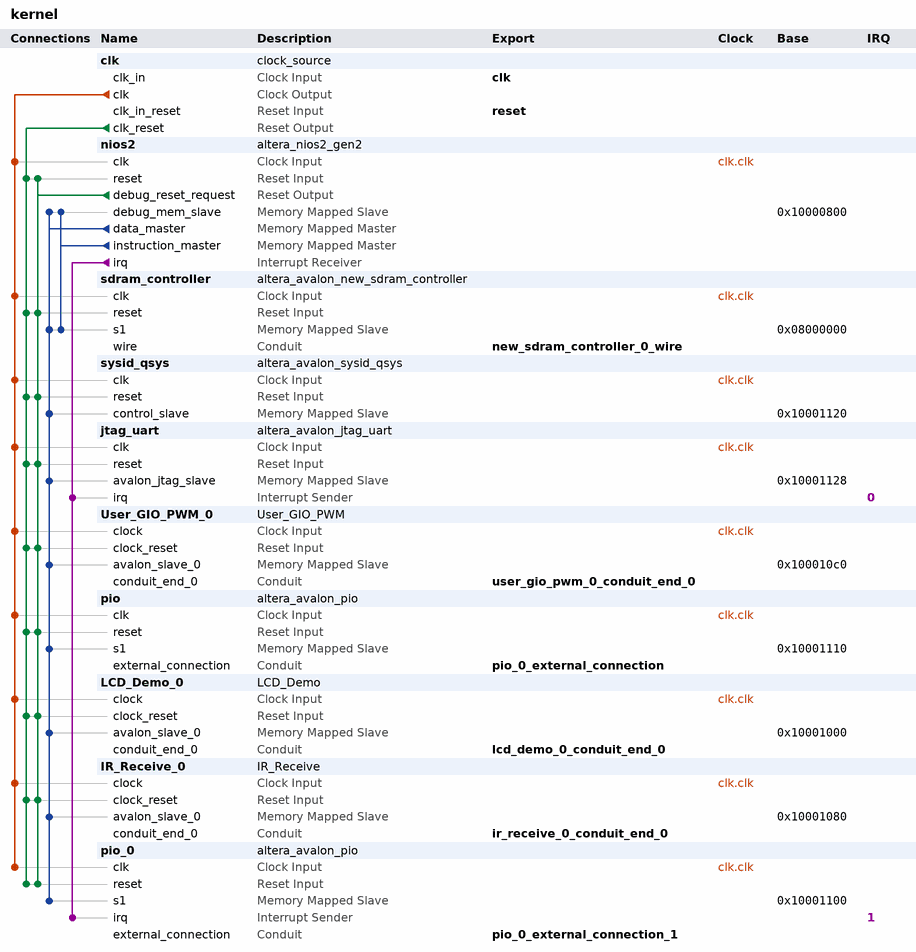
[diagram p0: system contents]
# Platform Designer (Qsys) system kernel, Cyclone IV E EP4CE115F29C7
# Parameters at their usual value, and those the tool derives, are not listed.
package require -exact qsys 15.0
create_system kernel
set_project_property DEVICE_FAMILY {Cyclone IV E}
set_project_property DEVICE EP4CE115F29C7

add_instance clk clock_source 15.0
set_instance_parameter_value clk clockFrequency 100000000

add_instance nios2 altera_nios2_gen2 15.0
set_instance_parameter_value nios2 dcache_size 0
set_instance_parameter_value nios2 debug_datatrigger 2
set_instance_parameter_value nios2 debug_hwbreakpoint 2
set_instance_parameter_value nios2 debug_traceType instruction_and_data_trace
set_instance_parameter_value nios2 exceptionSlave sdram_controller.s1
set_instance_parameter_value nios2 icache_size 4096
set_instance_parameter_value nios2 impl Fast
set_instance_parameter_value nios2 resetSlave sdram_controller.s1

add_instance sdram_controller altera_avalon_new_sdram_controller 15.0
set_instance_parameter_value sdram_controller TAC 5.5
set_instance_parameter_value sdram_controller TRCD 20.0
set_instance_parameter_value sdram_controller TRP 20.0
set_instance_parameter_value sdram_controller casLatency 3
set_instance_parameter_value sdram_controller columnWidth 10
set_instance_parameter_value sdram_controller dataWidth 32
set_instance_parameter_value sdram_controller generateSimulationModel false
set_instance_parameter_value sdram_controller model single_Micron_MT48LC4M32B2_7_chip
set_instance_parameter_value sdram_controller numberOfBanks 4
set_instance_parameter_value sdram_controller numberOfChipSelects 1
set_instance_parameter_value sdram_controller powerUpDelay 100.0
set_instance_parameter_value sdram_controller refreshPeriod 15.625
set_instance_parameter_value sdram_controller rowWidth 13

add_instance sysid_qsys altera_avalon_sysid_qsys 15.0
set_instance_parameter_value sysid_qsys id 1

add_instance jtag_uart altera_avalon_jtag_uart 15.0
set_instance_parameter_value jtag_uart simInteractiveOptions NO_INTERACTIVE_WINDOWS

add_instance User_GIO_PWM_0 User_GIO_PWM 1.0

add_instance pio altera_avalon_pio 15.0
set_instance_parameter_value pio direction Output
set_instance_parameter_value pio width 1

add_instance LCD_Demo_0 LCD_Demo 1.0

add_instance IR_Receive_0 IR_Receive 1.0

add_instance pio_0 altera_avalon_pio 15.0
set_instance_parameter_value pio_0 captureEdge true
set_instance_parameter_value pio_0 direction Input
set_instance_parameter_value pio_0 generateIRQ true
set_instance_parameter_value pio_0 irqType EDGE
set_instance_parameter_value pio_0 width 1

# connections
add_connection clk.clk IR_Receive_0.clock clock
add_connection clk.clk jtag_uart.clk clock
add_connection clk.clk LCD_Demo_0.clock clock
add_connection clk.clk nios2.clk clock
add_connection clk.clk pio.clk clock
add_connection clk.clk pio_0.clk clock
add_connection clk.clk sdram_controller.clk clock
add_connection clk.clk sysid_qsys.clk clock
add_connection clk.clk User_GIO_PWM_0.clock clock
add_connection clk.clk_reset IR_Receive_0.clock_reset reset
add_connection clk.clk_reset jtag_uart.reset reset
add_connection clk.clk_reset LCD_Demo_0.clock_reset reset
add_connection clk.clk_reset nios2.reset reset
add_connection clk.clk_reset pio.reset reset
add_connection clk.clk_reset pio_0.reset reset
add_connection clk.clk_reset sdram_controller.reset reset
add_connection clk.clk_reset sysid_qsys.reset reset
add_connection clk.clk_reset User_GIO_PWM_0.clock_reset reset
add_connection nios2.debug_reset_request IR_Receive_0.clock_reset reset
add_connection nios2.debug_reset_request jtag_uart.reset reset
add_connection nios2.debug_reset_request LCD_Demo_0.clock_reset reset
add_connection nios2.debug_reset_request nios2.reset reset
add_connection nios2.debug_reset_request pio.reset reset
add_connection nios2.debug_reset_request pio_0.reset reset
add_connection nios2.debug_reset_request sdram_controller.reset reset
add_connection nios2.debug_reset_request sysid_qsys.reset reset
add_connection nios2.debug_reset_request User_GIO_PWM_0.clock_reset reset
add_connection nios2.data_master IR_Receive_0.avalon_slave_0 avalon
set_connection_parameter_value nios2.data_master/IR_Receive_0.avalon_slave_0 baseAddress 0x10001080
add_connection nios2.data_master jtag_uart.avalon_jtag_slave avalon
set_connection_parameter_value nios2.data_master/jtag_uart.avalon_jtag_slave baseAddress 0x10001128
add_connection nios2.data_master LCD_Demo_0.avalon_slave_0 avalon
set_connection_parameter_value nios2.data_master/LCD_Demo_0.avalon_slave_0 baseAddress 0x10001000
add_connection nios2.data_master nios2.debug_mem_slave avalon
set_connection_parameter_value nios2.data_master/nios2.debug_mem_slave baseAddress 0x10000800
add_connection nios2.data_master pio.s1 avalon
set_connection_parameter_value nios2.data_master/pio.s1 baseAddress 0x10001110
add_connection nios2.data_master pio_0.s1 avalon
set_connection_parameter_value nios2.data_master/pio_0.s1 baseAddress 0x10001100
add_connection nios2.data_master sdram_controller.s1 avalon
set_connection_parameter_value nios2.data_master/sdram_controller.s1 baseAddress 0x08000000
add_connection nios2.data_master sysid_qsys.control_slave avalon
set_connection_parameter_value nios2.data_master/sysid_qsys.control_slave baseAddress 0x10001120
add_connection nios2.data_master User_GIO_PWM_0.avalon_slave_0 avalon
set_connection_parameter_value nios2.data_master/User_GIO_PWM_0.avalon_slave_0 baseAddress 0x100010c0
add_connection nios2.instruction_master nios2.debug_mem_slave avalon
set_connection_parameter_value nios2.instruction_master/nios2.debug_mem_slave baseAddress 0x10000800
add_connection nios2.instruction_master sdram_controller.s1 avalon
set_connection_parameter_value nios2.instruction_master/sdram_controller.s1 baseAddress 0x08000000
add_connection nios2.irq jtag_uart.irq interrupt
set_connection_parameter_value nios2.irq/jtag_uart.irq irqNumber 0
add_connection nios2.irq pio_0.irq interrupt
set_connection_parameter_value nios2.irq/pio_0.irq irqNumber 1

# exported interfaces
add_interface clk clock sink
set_interface_property clk EXPORT_OF clk.clk_in
add_interface ir_receive_0_conduit_end_0 conduit end
set_interface_property ir_receive_0_conduit_end_0 EXPORT_OF IR_Receive_0.conduit_end_0
add_interface lcd_demo_0_conduit_end_0 conduit end
set_interface_property lcd_demo_0_conduit_end_0 EXPORT_OF LCD_Demo_0.conduit_end_0
add_interface new_sdram_controller_0_wire conduit end
set_interface_property new_sdram_controller_0_wire EXPORT_OF sdram_controller.wire
add_interface pio_0_external_connection conduit end
set_interface_property pio_0_external_connection EXPORT_OF pio.external_connection
add_interface pio_0_external_connection_1 conduit end
set_interface_property pio_0_external_connection_1 EXPORT_OF pio_0.external_connection
add_interface reset reset sink
set_interface_property reset EXPORT_OF clk.clk_in_reset
add_interface user_gio_pwm_0_conduit_end_0 conduit end
set_interface_property user_gio_pwm_0_conduit_end_0 EXPORT_OF User_GIO_PWM_0.conduit_end_0

set_interconnect_requirement {$system} qsys_mm.clockCrossingAdapter HANDSHAKE
set_interconnect_requirement {$system} qsys_mm.enableEccProtection FALSE
set_interconnect_requirement {$system} qsys_mm.insertDefaultSlave FALSE
set_interconnect_requirement {$system} qsys_mm.maxAdditionalLatency 1

save_system kernel.qsys
